# Altium schematic sheet 控制板.SchDoc
size A2; Author: Dolphi; DrawnBy: Dolphi; : 空调控制器继电器版; Revision: 4.0
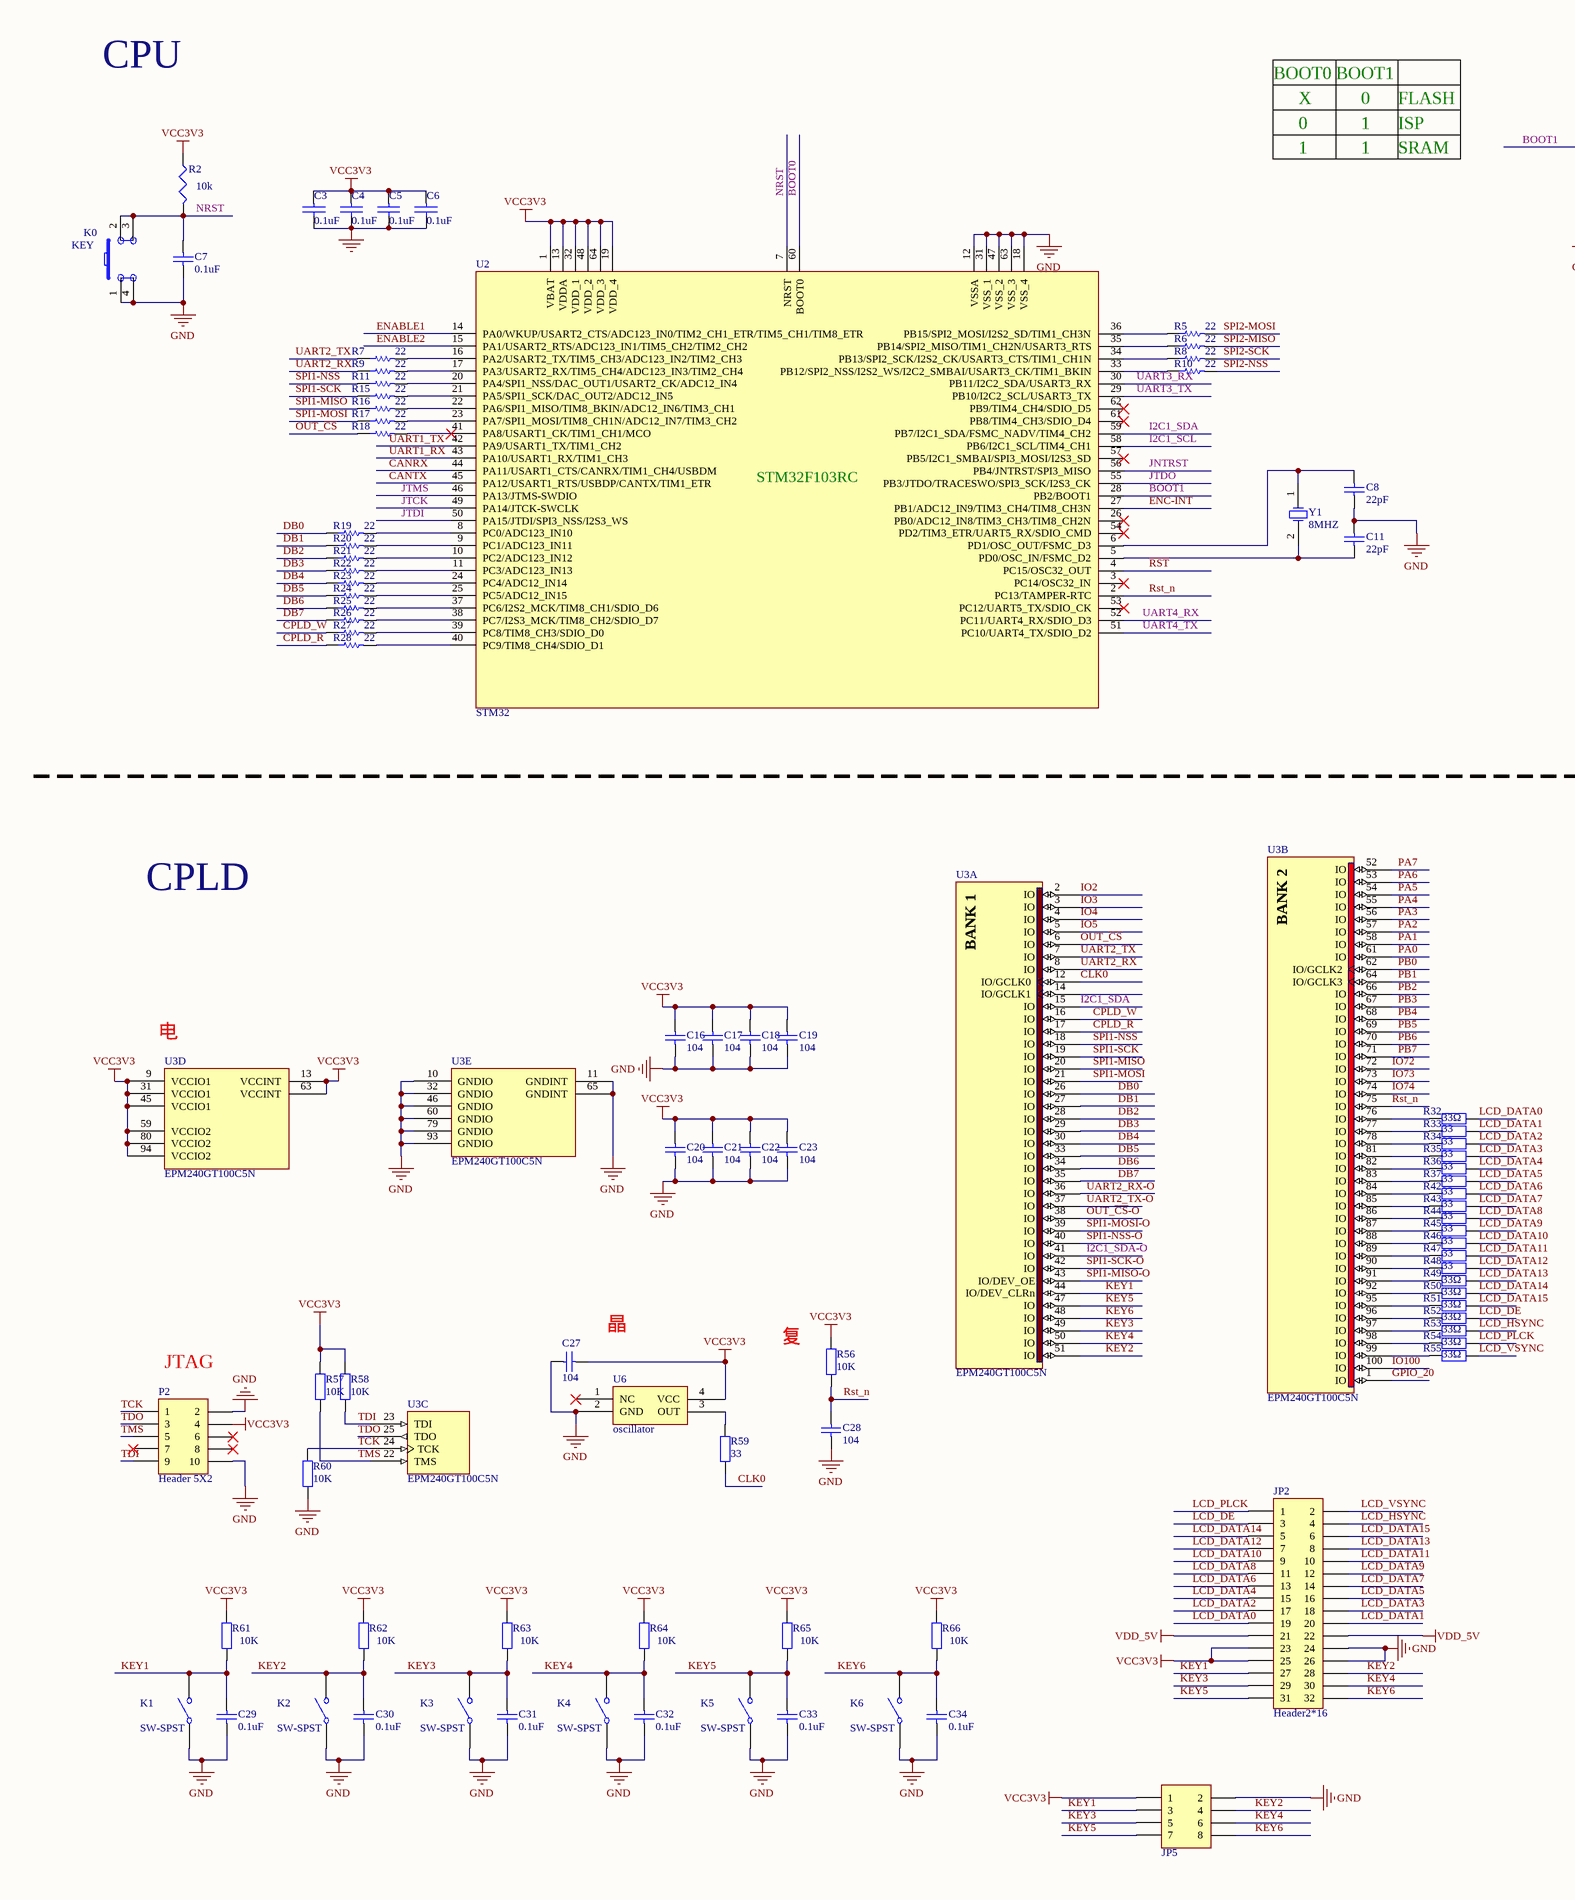
[diagram p0: 控制板.SchDoc, left]
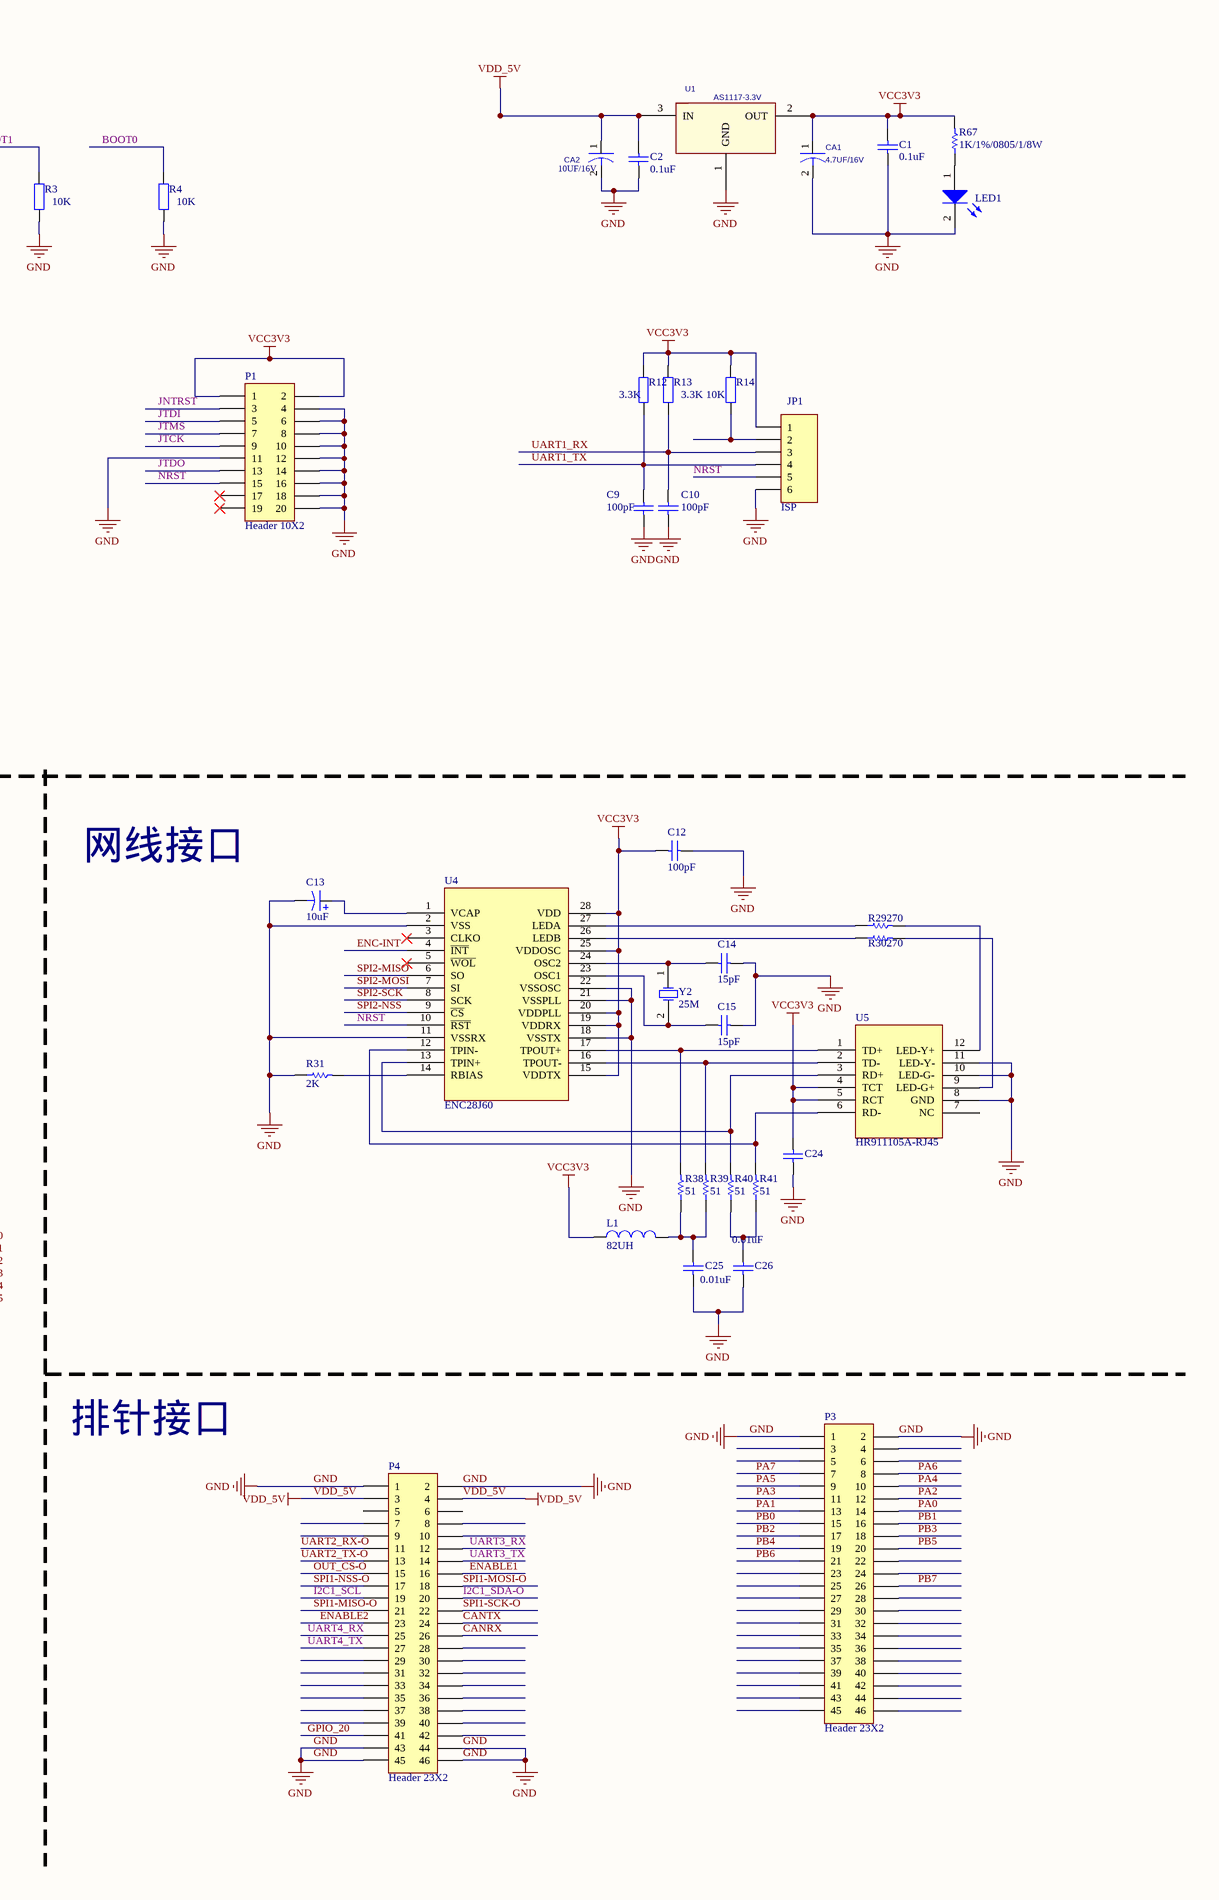
[diagram p1: 控制板.SchDoc, right]

## Parts
C1  0.1uF  [C0805]
C2  0.1uF  [C0805]
C3  0.1uF  [C0805]
C4  0.1uF  [C0805]
C5  0.1uF  [C0805]
C6  0.1uF  [C0805]
C7  0.1uF  [C0805]
C8  22pF  [C0805]
C9  100pF  [C0805]
C10  100pF  [C0805]
C11  22pF  [C0805]
C12  value 100pF  [C0805]  (hidden comment: 0.01uF)
C13  value 10uF  [3528cap]  (hidden comment: 10uF/16V)
C14  15pF  [C0805]
C15  15pF  [C0805]
C16  value 104  [C0805]  (hidden comment: 0.1uF)
C17  value 104  [C0805]  (hidden comment: 0.1uF)
C18  value 104  [C0805]  (hidden comment: 0.1uF)
C19  value 104  [C0805]  (hidden comment: 0.1uF)
C20  value 104  [C0805]  (hidden comment: 0.1uF)
C21  value 104  [C0805]  (hidden comment: 0.1uF)
C22  value 104  [C0805]  (hidden comment: 0.1uF)
C23  value 104  [C0805]  (hidden comment: 0.1uF)
C24  0.1uF  [C0805]  (value not drawn)
C25  0.01uF  [C0805]
C26  0.01uF  [C0805]
C27  value 104  [C0805]  (hidden comment: 0.1uF)
C28  value 104  [C0805]  (hidden comment: 0.1uF)
C29  0.1uF  [C0805]
C30  0.1uF  [C0805]
C31  0.1uF  [C0805]
C32  0.1uF  [C0805]
C33  0.1uF  [C0805]
C34  0.1uF  [C0805]
CA1  4.7UF/16V  [3528cap]
CA2  10UF/16V  [3528cap]
JP1  ISP  [PIN-FHEADER-1*6-2.54]
JP2  Header2*16  [PIN-S-2.54-2*16]
JP5  Header2*4  [PIN-S-2.54-2*4]  (value not drawn)
K0  KEY  [KEY-DIP]
K1  SW-SPST  [KEY-DIP]
K2  SW-SPST  [KEY-DIP]
K3  SW-SPST  [KEY-DIP]
K4  SW-SPST  [KEY-DIP]
K5  SW-SPST  [KEY-DIP]
K6  SW-SPST  [KEY-DIP]
L1  82UH  [R0805]
LED1  0805/Green  [LED-0805]  (value not drawn)
P1  Header 10X2  [IDC-20]
P2  Header 5X2  [HDR2X5]
P3  Header 23X2  [HDR2X23]
P4  Header 23X2  [HDR2X23]
R2  10k  [R0805]
R3  10K  [R0805]
R4  10K  [R0805]
R5  value 22  [R0805]  (hidden comment: 22Ω)
R6  value 22  [R0805]  (hidden comment: 22Ω)
R7  value 22  [R0805]  (hidden comment: 22Ω)
R8  value 22  [R0805]  (hidden comment: 22Ω)
R9  value 22  [R0805]  (hidden comment: 22Ω)
R10  value 22  [R0805]  (hidden comment: 22Ω)
R11  value 22  [R0805]  (hidden comment: 22Ω)
R12  3.3K  [R0805]
R13  3.3K  [R0805]
R14  10K  [R0805]
R15  value 22  [R0805]  (hidden comment: 22Ω)
R16  value 22  [R0805]  (hidden comment: 22Ω)
R17  value 22  [R0805]  (hidden comment: 22Ω)
R18  value 22  [R0805]  (hidden comment: 22Ω)
R19  value 22  [R0805]  (hidden comment: 22Ω)
R20  value 22  [R0805]  (hidden comment: 22Ω)
R21  value 22  [R0805]  (hidden comment: 22Ω)
R22  value 22  [R0805]  (hidden comment: 22Ω)
R23  value 22  [R0805]  (hidden comment: 22Ω)
R24  value 22  [R0805]  (hidden comment: 22Ω)
R25  value 22  [R0805]  (hidden comment: 22Ω)
R26  value 22  [R0805]  (hidden comment: 22Ω)
R27  value 22  [R0805]  (hidden comment: 22Ω)
R28  value 22  [R0805]  (hidden comment: 22Ω)
R29  value 270  [R0805]  (hidden comment: 270Ω)
R30  value 270  [R0805]  (hidden comment: 270Ω)
R31  2K  [R0805]
R32  33Ω  value 33  [R0805]
R33  value 33  [R0805]  (hidden comment: 33Ω)
R34  value 33  [R0805]  (hidden comment: 33Ω)
R35  value 33  [R0805]  (hidden comment: 33Ω)
R36  value 33  [R0805]  (hidden comment: 33Ω)
R37  value 33  [R0805]  (hidden comment: 33Ω)
R38  value 51  [R0805]  (hidden comment: 51Ω)
R39  value 51  [R0805]  (hidden comment: 51Ω)
R40  value 51  [R0805]  (hidden comment: 51Ω)
R41  value 51  [R0805]  (hidden comment: 51Ω)
R42  value 33  [R0805]  (hidden comment: 33Ω)
R43  value 33  [R0805]  (hidden comment: 33Ω)
R44  value 33  [R0805]  (hidden comment: 33Ω)
R45  value 33  [R0805]  (hidden comment: 33Ω)
R46  value 33  [R0805]  (hidden comment: 33Ω)
R47  value 33  [R0805]  (hidden comment: 33Ω)
R48  33Ω  [R0805]  (value not drawn)
R49  33Ω  [R0805]
R50  33Ω  [R0805]
R51  33Ω  [R0805]
R52  33Ω  [R0805]
R53  33Ω  [R0805]
R54  33Ω  [R0805]
R55  33Ω  [R0805]
R56  10K  [R0805]
R57  10K  [R0805]
R58  10K  [R0805]
R59  value 33  [R0805]  (hidden comment: 33Ω)
R60  10K  [R0805]
R61  10K  [R0805]
R62  10K  [R0805]
R63  10K  [R0805]
R64  10K  [R0805]
R65  10K  [R0805]
R66  10K  [R0805]
R67  1K/1%/0805/1/8W  [R-0805]
U1  AS1117-3.3V  [SOT-223]
U2  STM32  [LQFP64]
U3  EPM240GT100C5N  [TQFP100_N]  (parts A,B,C,D,E of 5)
U4  ENC28J60  [ENC28J60-ss]
U5  HR911105A-RJ45  [HR911105A]
U6  oscillator  [JZ]
Y1  8MHZ  [XTAL]
Y2  25M  [xtal]

## Nets
GND: C1.1 C2.1 C3.2 C4.2 C5.2 C6.2 C7.1 C8.2 C9.1 C10.1 C11.1 C12.2 C13.2 C14.2 C15.2 C16.1 C17.1 C18.1 C19.1 C20.1 C21.1 C22.1 C23.1 C24.2 C25.1 C26.1 C27.1 C28.1 C29.1 C30.1 C31.1 C32.1 C33.1 C34.1 CA1.2 CA2.2 JP1.6 JP2.24 JP2.26 JP5.2 K0.1 K0.4 K1.1(COMMON) K2.1(COMMON) K3.1(COMMON) K4.1(COMMON) K5.1(COMMON) K6.1(COMMON) LED1.2(K) P1.4 P1.6 P1.8 P1.10 P1.11 P1.12 P1.14 P1.16 P1.18 P1.20 P2.2 P2.10 P3.1 P3.2 P4.1 P4.2 P4.43 P4.44 P4.45 P4.46 R3.1 R4.1 R31.1 R60.1 U1.1(GND) U2.12(VSSA) U2.18(VSS_4) U2.31(VSS_1) U2.47(VSS_2) U2.63(VSS_3) U3.10(GNDIO) U3.11(GNDINT) U3.32(GNDIO) U3.46(GNDIO) U3.60(GNDIO) U3.65(GNDINT) U3.79(GNDIO) U3.93(GNDIO) U4.2(VSS) U4.11(VSSRX) U4.18(VSSTX) U4.21(VSSPLL) U4.22(VSSOSC) U5.8(GND) U5.10(LED-G-) U5.11(LED-Y-) U6.2(GND)
VCC3V3: C1.2 C3.1 C4.1 C5.1 C6.1 C12.1 C16.2 C17.2 C18.2 C19.2 C20.2 C21.2 C22.2 C23.2 C24.1 C27.2 CA1.1 JP1.1 JP2.23 JP2.25 JP5.1 L1.1 P1.1 P1.2 P2.4 R2.1 R12.2 R13.2 R14.2 R56.2 R57.2 R58.2 R61.2 R62.2 R63.2 R64.2 R65.2 R66.2 R67.2 U1.2(OUT) U2.1(VBAT) U2.13(VDDA) U2.19(VDD_4) U2.32(VDD_1) U2.48(VDD_2) U2.64(VDD_3) U3.9(VCCIO1) U3.13(VCCINT) U3.31(VCCIO1) U3.45(VCCIO1) U3.59(VCCIO2) U3.63(VCCINT) U3.80(VCCIO2) U3.94(VCCIO2) U4.15(VDDTX) U4.19(VDDRX) U4.20(VDDPLL) U4.25(VDDOSC) U4.28(VDD) U5.4(TCT) U5.5(RCT) U6.4(VCC)
VDD_5V: C2.2 CA2.1 JP2.21 JP2.22 P4.3 P4.4 U1.3(IN)
BOOT0: R4.2 U2.60(BOOT0)
BOOT1: R3.2 U2.28(PB2/BOOT1)
CANRX: P4.26 U2.44(PA11/USART1_CTS/CANRX/TIM1_CH4/USBDM)
CANTX: P4.24 U2.45(PA12/USART1_RTS/USBDP/CANTX/TIM1_ETR)
CLK0: R59.1 U3.12(IO/GCLK0)
CPLD_R: R28.1 U3.17(IO)
CPLD_W: R27.1 U3.16(IO)
DB0: R19.1 U3.26(IO)
DB1: R20.1 U3.27(IO)
DB2: R21.1 U3.28(IO)
DB3: R22.1 U3.29(IO)
DB4: R23.1 U3.30(IO)
DB5: R24.1 U3.33(IO)
DB6: R25.1 U3.34(IO)
DB7: R26.1 U3.35(IO)
ENABLE1: P4.16 U2.14(PA0/WKUP/USART2_CTS/ADC123_IN0/TIM2_CH1_ETR/TIM5_CH1/TIM8_ETR)
ENABLE2: P4.23 U2.15(PA1/USART2_RTS/ADC123_IN1/TIM5_CH2/TIM2_CH2)
ENC-INT: U2.27(PB1/ADC12_IN9/TIM3_CH4/TIM8_CH3N) U4.4(~{INT})
GPIO_20: P4.41 U3.1(IO)
I2C1_SCL: P4.19 U2.58(PB6/I2C1_SCL/TIM4_CH1)
I2C1_SDA: U2.59(PB7/I2C1_SDA/FSMC_NADV/TIM4_CH2) U3.15(IO)
I2C1_SDA-O: P4.20 U3.41(IO)
IO2: U3.2(IO)
IO3: U3.3(IO)
IO4: U3.4(IO)
IO5: U3.5(IO)
IO72: U3.72(IO)
IO73: U3.73(IO)
IO74: U3.74(IO)
IO100: U3.100(IO)
JNTRST: P1.3 U2.56(PB4/JNTRST/SPI3_MISO)
JTCK: P1.9 U2.49(PA14/JTCK-SWCLK)
JTDI: P1.5 U2.50(PA15/JTDI/SPI3_NSS/I2S3_WS)
JTDO: P1.13 U2.55(PB3/JTDO/TRACESWO/SPI3_SCK/I2S3_CK)
JTMS: P1.7 U2.46(PA13/JTMS-SWDIO)
KEY1: C29.2 JP2.27 JP5.3 K1.2(NO) R61.1 U3.44(IO/DEV_CLRn)
KEY2: C30.2 JP2.28 JP5.4 K2.2(NO) R62.1 U3.51(IO)
KEY3: C31.2 JP2.29 JP5.5 K3.2(NO) R63.1 U3.49(IO)
KEY4: C32.2 JP2.30 JP5.6 K4.2(NO) R64.1 U3.50(IO)
KEY5: C33.2 JP2.31 JP5.7 K5.2(NO) R65.1 U3.47(IO)
KEY6: C34.2 JP2.32 JP5.8 K6.2(NO) R66.1 U3.48(IO)
LCD_DATA0: JP2.19 R32.1
LCD_DATA1: JP2.20 R33.1
LCD_DATA2: JP2.17 R34.1
LCD_DATA3: JP2.18 R35.1
LCD_DATA4: JP2.15 R36.1
LCD_DATA5: JP2.16 R37.1
LCD_DATA6: JP2.13 R42.1
LCD_DATA7: JP2.14 R43.1
LCD_DATA8: JP2.11 R44.1
LCD_DATA9: JP2.12 R45.1
LCD_DATA10: JP2.9 R46.1
LCD_DATA11: JP2.10 R47.1
LCD_DATA12: JP2.7 R48.1
LCD_DATA13: JP2.8 R49.1
LCD_DATA14: JP2.5 R50.1
LCD_DATA15: JP2.6 R51.1
LCD_DE: JP2.3 R52.1
LCD_HSYNC: JP2.4 R53.1
LCD_PLCK: JP2.1 R54.1
LCD_VSYNC: JP2.2 R55.1
NRST: C7.2 JP1.5 K0.2 K0.3 P1.15 R2.2 U2.7(NRST) U4.10(~{RST})
OUT_~{CS}: R18.1 U3.6(IO)
OUT_~{CS}-O: P4.15 U3.38(IO)
PA0: P3.14 U3.61(IO)
PA1: P3.13 U3.58(IO)
PA2: P3.12 U3.57(IO)
PA3: P3.11 U3.56(IO)
PA4: P3.10 U3.55(IO)
PA5: P3.9 U3.54(IO)
PA6: P3.8 U3.53(IO)
PA7: P3.7 U3.52(IO)
PB0: P3.15 U3.62(IO/GCLK2)
PB1: P3.16 U3.64(IO/GCLK3)
PB2: P3.17 U3.66(IO)
PB3: P3.18 U3.67(IO)
PB4: P3.19 U3.68(IO)
PB5: P3.20 U3.69(IO)
PB6: P3.21 U3.70(IO)
PB7: P3.26 U3.71(IO)
~{RST}: U2.4(PC15/OSC32_OUT)
Rst_n: C28.2 R56.1 U2.2(PC13/TAMPER-RTC) U3.75(IO)
SPI1-MISO: R16.1 U3.20(IO)
SPI1-MISO-O: P4.21 U3.43(IO/DEV_OE)
SPI1-MOSI: R17.1 U3.21(IO)
SPI1-MOSI-O: P4.18 U3.39(IO)
SPI1-NSS: R11.1 U3.18(IO)
SPI1-NSS-O: P4.17 U3.40(IO)
SPI1-SCK: R15.1 U3.19(IO)
SPI1-SCK-O: P4.22 U3.42(IO)
SPI2-MISO: R6.2 U4.6(SO)
SPI2-MOSI: R5.2 U4.7(SI)
SPI2-NSS: R10.2 U4.9(~{CS})
SPI2-SCK: R8.2 U4.8(SCK)
TCK: P2.1 R60.2 U3.24(TCK)
TDI: P2.9 R58.1 U3.23(TDI)
TDO: P2.3 U3.25(TDO)
TMS: P2.5 R57.1 U3.22(TMS)
UART1_RX: C10.2 JP1.3 R13.1 U2.43(PA10/USART1_RX/TIM1_CH3)
UART1_TX: C9.2 JP1.4 R12.1 U2.42(PA9/USART1_TX/TIM1_CH2)
UART2_RX: R9.1 U3.8(IO)
UART2_RX-O: P4.11 U3.36(IO)
UART2_TX: R7.1 U3.7(IO)
UART2_TX-O: P4.13 U3.37(IO)
UART3_RX: P4.12 U2.30(PB11/I2C2_SDA/USART3_RX)
UART3_TX: P4.14 U2.29(PB10/I2C2_SCL/USART3_TX)
UART4_RX: P4.25 U2.52(PC11/UART4_RX/SDIO_D3)
UART4_TX: P4.27 U2.51(PC10/UART4_TX/SDIO_D2)
NetC8_1: C8.1 U2.6(PD1/OSC_OUT/FSMC_D3) Y1.1(OSC1)
NetC11_2: C11.2 U2.5(PD0/OSC_IN/FSMC_D2) Y1.2(OSC2)
NetC13_1: C13.1 U4.1(VCAP)
NetC14_1: C14.1 U4.24(OSC2) Y2.1(OSC1)
NetC15_1: C15.1 U4.23(OSC1) Y2.2(OSC2)
NetC25_2: C25.2 L1.2 R38.1 R39.1
NetC26_2: C26.2 R40.1 R41.1
NetJP1_2: JP1.2 R14.1
NetLED1_1: LED1.1(A) R67.1
NetR5_1: R5.1 U2.36(PB15/SPI2_MOSI/I2S2_SD/TIM1_CH3N)
NetR6_1: R6.1 U2.35(PB14/SPI2_MISO/TIM1_CH2N/USART3_RTS)
NetR7_2: R7.2 U2.16(PA2/USART2_TX/TIM5_CH3/ADC123_IN2/TIM2_CH3)
NetR8_1: R8.1 U2.34(PB13/SPI2_SCK/I2S2_CK/USART3_CTS/TIM1_CH1N)
NetR9_2: R9.2 U2.17(PA3/USART2_RX/TIM5_CH4/ADC123_IN3/TIM2_CH4)
NetR10_1: R10.1 U2.33(PB12/SPI2_NSS/I2S2_WS/I2C2_SMBAI/USART3_CK/TIM1_BKIN)
NetR11_2: R11.2 U2.20(PA4/SPI1_NSS/DAC_OUT1/USART2_CK/ADC12_IN4)
NetR15_2: R15.2 U2.21(PA5/SPI1_SCK/DAC_OUT2/ADC12_IN5)
NetR16_2: R16.2 U2.22(PA6/SPI1_MISO/TIM8_BKIN/ADC12_IN6/TIM3_CH1)
NetR17_2: R17.2 U2.23(PA7/SPI1_MOSI/TIM8_CH1N/ADC12_IN7/TIM3_CH2)
NetR18_2: R18.2 U2.41(PA8/USART1_CK/TIM1_CH1/MCO)
NetR19_2: R19.2 U2.8(PC0/ADC123_IN10)
NetR20_2: R20.2 U2.9(PC1/ADC123_IN11)
NetR21_2: R21.2 U2.10(PC2/ADC123_IN12)
NetR22_2: R22.2 U2.11(PC3/ADC123_IN13)
NetR23_2: R23.2 U2.24(PC4/ADC12_IN14)
NetR24_2: R24.2 U2.25(PC5/ADC12_IN15)
NetR25_2: R25.2 U2.37(PC6/I2S2_MCK/TIM8_CH1/SDIO_D6)
NetR26_2: R26.2 U2.38(PC7/I2S3_MCK/TIM8_CH2/SDIO_D7)
NetR27_2: R27.2 U2.39(PC8/TIM8_CH3/SDIO_D0)
NetR28_2: R28.2 U2.40(PC9/TIM8_CH4/SDIO_D1)
NetR29_1: R29.1 U4.27(LEDA)
NetR29_2: R29.2 U5.12(LED-Y+)
NetR30_1: R30.1 U4.26(LEDB)
NetR30_2: R30.2 U5.9(LED-G+)
NetR31_2: R31.2 U4.14(RBIAS)
NetR32_2: R32.2 U3.76(IO)
NetR33_2: R33.2 U3.77(IO)
NetR34_2: R34.2 U3.78(IO)
NetR35_2: R35.2 U3.81(IO)
NetR36_2: R36.2 U3.82(IO)
NetR37_2: R37.2 U3.83(IO)
NetR38_2: R38.2 U4.17(TPOUT+) U5.1(TD+)
NetR39_2: R39.2 U4.16(TPOUT-) U5.2(TD-)
NetR40_2: R40.2 U4.13(TPIN+) U5.3(RD+)
NetR41_2: R41.2 U4.12(TPIN-) U5.6(RD-)
NetR42_2: R42.2 U3.84(IO)
NetR43_2: R43.2 U3.85(IO)
NetR44_2: R44.2 U3.86(IO)
NetR45_2: R45.2 U3.87(IO)
NetR46_2: R46.2 U3.88(IO)
NetR47_2: R47.2 U3.89(IO)
NetR48_2: R48.2 U3.90(IO)
NetR49_2: R49.2 U3.91(IO)
NetR50_2: R50.2 U3.92(IO)
NetR51_2: R51.2 U3.95(IO)
NetR52_2: R52.2 U3.96(IO)
NetR53_2: R53.2 U3.97(IO)
NetR54_2: R54.2 U3.98(IO)
NetR55_2: R55.2 U3.99(IO)
NetR59_2: R59.2 U6.3(OUT)

Not connected (* = marked no-connect by the designer): P1 17* 19*; P2 6* 7* 8*; P3 3 4 5 6 22 23 24 25 27 28 29 30 31 32 33 34 35 36 37 38 39 40 41 42 43 44 45 46; P4 5 6 7 8 9 10 28 29 30 31 32 33 34 35 36 37 38 39 40 42; U2 3(PC14/OSC32_IN)* 26(PB0/ADC12_IN8/TIM3_CH3/TIM8_CH2N)* 53(PC12/UART5_TX/SDIO_CK)* 54(PD2/TIM3_ETR/UART5_RX/SDIO_CMD)* 57(PB5/I2C1_SMBAI/SPI3_MOSI/I2S3_SD)* 61(PB8/TIM4_CH3/SDIO_D4)* 62(PB9/TIM4_CH4/SDIO_D5)*; U3 14(IO/GCLK1); U4 3(CLKO)* 5(~{WOL})*; U5 7(NC); U6 1(NC)*

## Notes on the sheet
- CPU
- BOOT0
- X
- 0
- BOOT1
- 1
- FLASH
- ISP
- SRAM
- 网线接口
- CPLD
- (near U3) 电
- (near P2) JTAG
- 晶
- (near R56) 复
- 排针接口
- (in symbol EPM240GT100C5N, part A) BANK 1
- (in symbol EPM240GT100C5N, part B) BANK 2
- (in symbol STM32F103RE) STM32F103RC

## Library data of the parts
C1 C2 C7 C14 C15 C24-C26 C29-C34 = Cap: Capacitor; Value: 100pF; Published: 8-Jun-2000; LatestRevisionDate: 17-Jul-2002; LatestRevisionNote: Re-released for DXP Platform.; Publisher: Altium Limited
  C1 C2 C14 C15 C24-C26: PackageReference: RAD-0.3; PackageDescription: Radial Cap, Thru-Hole; 2 Leads; 0.3 in Pin Spacing
C3-C6 C8-C12 C16-C23 C27 C28 = Cap: Capacitor
  C8 C11: Published: 8-Jun-2000; LatestRevisionDate: 17-Jul-2002; LatestRevisionNote: Re-released for DXP Platform.; PackageReference: RAD-0.3; Publisher: Altium Limited; Value: 22pF
  C9 C10: Published: 8-Jun-2000; LatestRevisionDate: 17-Jul-2002; LatestRevisionNote: Re-released for DXP Platform.; Publisher: Altium Limited; Value: 100pF
  C12: Published: 8-Jun-2000; LatestRevisionDate: 17-Jul-2002; LatestRevisionNote: Re-released for DXP Platform.; PackageReference: RAD-0.3; Publisher: Altium Limited; PackageDescription: Radial Cap, Thru-Hole; 2 Leads; 0.3 in Pin Spacing
  C16-C23 C27 C28: Published: 8-Jun-2000; LatestRevisionDate: 17-Jul-2002; LatestRevisionNote: Re-released for DXP Platform.; PackageReference: RAD-0.3; Publisher: Altium Limited
C13 = Cap Pol3: Polarized Capacitor (Surface Mount); Published: 8-Jun-2000; LatestRevisionDate: 29-May-2009; LatestRevisionNote: IPC-7351 Footprint Added.; PackageReference: C0805; Publisher: Altium Limited; PackageDescription: Chip Capacitor
CA1 CA2 = ECAP
JP1 = Header1*6
K1-K6 = SW-SPST: Single-Pole, Single-Throw Switch; Published: 24-Mar-1999; LatestRevisionDate: 17-Jul-2002; LatestRevisionNote: Re-released for DXP Platform.; PackageReference: SPST-2; Publisher: Altium Limited
L1 = Inductor: Code_IEC: 1005; Published: 8-Jun-2000; LatestRevisionDate: 29-May-2009; LatestRevisionNote: IPC-7351 Footprint Added.; PackageReference: 0402-A; Publisher: Altium Limited; PackageDescription: Chip Inductor; Code_JEITA: 0402; Value: 82UH
LED1 = ASD-0012AA: 名称: 发光二极管; 型号: 17-21SYGC/S530-E1 TR8; 品牌: everlight; 原编码: S-118-GX; OK?: □; Part Number: ASD-0012AA; 规格: 0805/Green
P1 = Header 10X2: Header, 10-Pin, Dual row; LatestRevisionDate: 17-Jul-2002; LatestRevisionNote: Re-released for DXP Platform.; Publisher: Altium Limited
P2 = Header 5X2: Header, 5-Pin, Dual row; LatestRevisionDate: 17-Jul-2002; LatestRevisionNote: Re-released for DXP Platform.; Publisher: Altium Limited
P3 P4 = Header 23X2: Header, 23-Pin, Dual row; LatestRevisionDate: 17-Jul-2002; LatestRevisionNote: Re-released for DXP Platform.; Publisher: Altium Limited
R2 = Res3: Resistor; Value: 1K; Published: 8-Jun-2000; LatestRevisionDate: 17-Jul-2002; LatestRevisionNote: Re-released for DXP Platform.; Publisher: Altium Limited
R3 R4 R12-R14 R32-R37 R42-R66 = Res2: Resistor; Published: 8-Jun-2000; LatestRevisionDate: 17-Jul-2002; LatestRevisionNote: Re-released for DXP Platform.; PackageReference: AXIAL-0.4; Publisher: Altium Limited
  R3 R4 R14 R56-R58 R60-R66: Value: 10K
  R12 R13: Value: 3.3K
R5-R11 R15-R31 R38-R41 = Res Semi: Semiconductor Resistor; Published: 8-Jun-2000; LatestRevisionDate: 17-Jul-2002; LatestRevisionNote: Re-released for DXP Platform.; PackageReference: AXIAL-0.5; Publisher: Altium Limited
  R31: Value: 2K
R67 = ASR-0028BA: Part Number: ASR-0058AA; 名称: 贴片电阻; 型号: RC0805FR-071KL; 品牌: YAGEO; 规格: 1K/1%/0805/1/8W
U1 = AS1117
U2 = STM32F103RE
U3 = EPM240GT100C5N: MAX II 1.8V CPLD, 80 IOs, 240 Logic Elements, 100-Pin Plastic TQFP, Commercial Temperature, Speed Grade 5, Pb-Free; Note: Each set of VCCIO pins can be connected to 3.3V, 2.5V, 1.8V, or 1.5V.; Note: All VCCINT pins must be connected to 1.8V.; Published: 4-Mar-2005; LatestRevisionDate: 13-Apr-2006; LatestRevisionNote: IPC-7351 Footprint Added.; DatasheetVersion: ver1.8, Jul-2006; PackageVersion: ver14.3, Jul-2006; PackageReference: TQFP100; Publisher: Altium Limited; PackageDescription: 100-Pin Plastic Thin Quad Flat Pack (TQFP100); Code_JEDEC: MS-026-AED; ComponentLink1Description: Manufacturer Link; ComponentLink1URL: http://www.altera.com/products/devices/cpld/max2/mx2-index.jsp; ComponentLink2Description: Handbook; ComponentLink2URL: http://www.altera.com/literature/hb/max2/max2_mii5v1.pdf; ComponentLink3Description: Packaging Specification; ComponentLink3URL: http://www.altera.com/literature/ds/dspkg.pdf
Y1 Y2 = XTAL: Crystal Oscillator; Published: 8-Jun-2000; LatestRevisionDate: 17-Jul-2002; LatestRevisionNote: Re-released for DXP Platform.; PackageReference: R38; Publisher: Altium Limited
JP5 = Header2*4: Revision: 17-Jul-2002: Re-released for DXP Platform.